# Altium schematic sheet DRIVER_A.SchDoc
size 420 x 297 mm; SheetNumber: 2; PageSetup: Record=PageOptions|CenterHorizontal=False|CenterVertical=False|PrintScale=0.95|XCorrection=0.00|YCorrection=0.00|PrintKind=1|BorderSize=5000000|LeftOffset=0|BottomOffset=0|Orientation=1|PaperLength=1000|PaperWidth=1000|Scale=100|PaperSource=15|PrintQuality=600|MediaType=1|DitherType=10|PaperKind=A4|PrintScaleMode=1
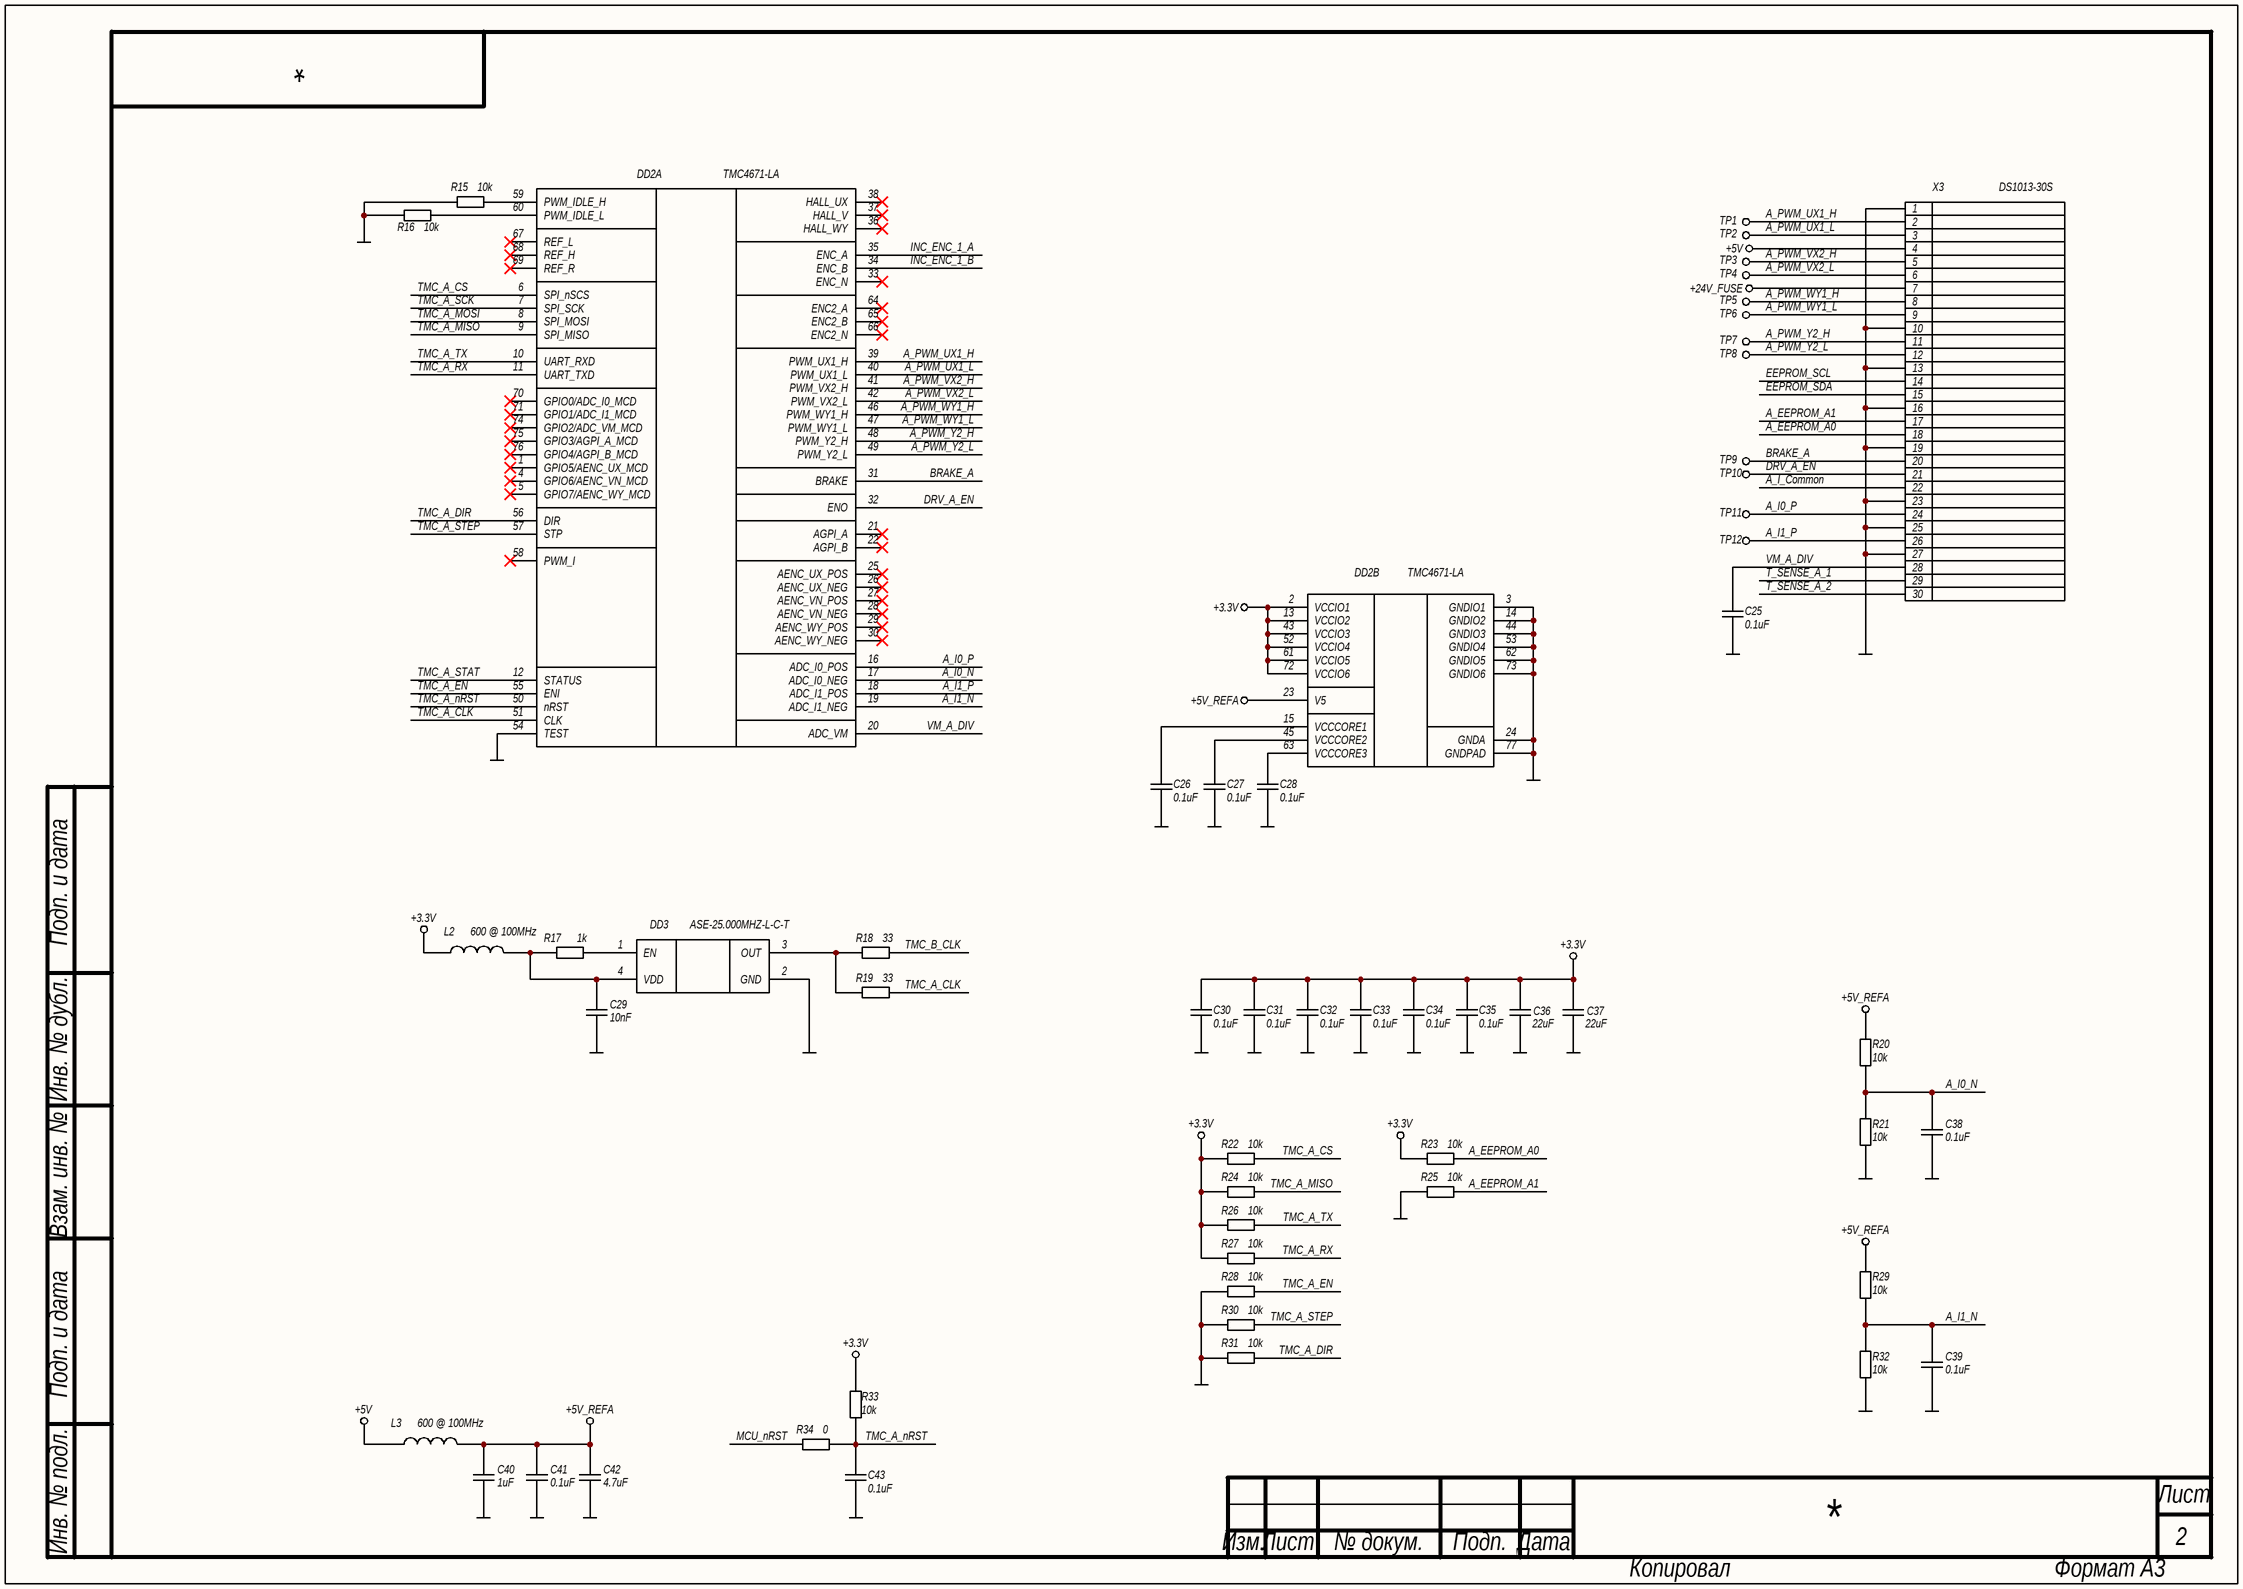
[diagram p0: DRIVER_A.SchDoc]

## Parts
C25  0.1uF  [C0603N]
C26  0.1uF  [C0603N]
C27  0.1uF  [C0603N]
C28  0.1uF  [C0603N]
C29  10nF  [C0603N]
C30  0.1uF  [C0603N]
C31  0.1uF  [C0603N]
C32  0.1uF  [C0603N]
C33  0.1uF  [C0603N]
C34  0.1uF  [C0603N]
C35  0.1uF  [C0603N]
C36  22uF  [C0805N]
C37  22uF  [C0805N]
C38  0.1uF  [C0603N]
C39  0.1uF  [C0603N]
C40  1uF  [C0603N]
C41  0.1uF  [C0603N]
C42  4.7uF  [C0603N]
C43  0.1uF  [C0603N]
DD2  TMC4671-LA  [QFN76-EP]  (parts A,B of 2)
DD3  ASE-25.000MHZ-L-C-T  [ASE]
L2  600 @ 100MHz  [FB0603N]
L3  600 @ 100MHz  [FB0603N]
R15  10k  [R0603N]
R16  10k  [R0603N]
R17  1k  [R0603N]
R18  33  [R0603N]
R19  33  [R0603N]
R20  10k  [R0603N]
R21  10k  [R0603N]
R22  10k  [R0603N]
R23  10k  [R0603N]
R24  10k  [R0603N]
R25  10k  [R0603N]
R26  10k  [R0603N]
R27  10k  [R0603N]
R28  10k  [R0603N]
R29  10k  [R0603N]
R30  10k  [R0603N]
R31  10k  [R0603N]
R32  10k  [R0603N]
R33  10k  [R0603N]
R34  0  [R0603N]
TP1  TEST_POINT  [TP_RPAD_0.8MM]  (value not drawn)  (no BOM)
TP2  TEST_POINT  [TP_RPAD_0.8MM]  (value not drawn)  (no BOM)
TP3  TEST_POINT  [TP_RPAD_0.8MM]  (value not drawn)  (no BOM)
TP4  TEST_POINT  [TP_RPAD_0.8MM]  (value not drawn)  (no BOM)
TP5  TEST_POINT  [TP_RPAD_0.8MM]  (value not drawn)  (no BOM)
TP6  TEST_POINT  [TP_RPAD_0.8MM]  (value not drawn)  (no BOM)
TP7  TEST_POINT  [TP_RPAD_0.8MM]  (value not drawn)  (no BOM)
TP8  TEST_POINT  [TP_RPAD_0.8MM]  (value not drawn)  (no BOM)
TP9  TEST_POINT  [TP_RPAD_0.8MM]  (value not drawn)  (no BOM)
TP10  TEST_POINT  [TP_RPAD_0.8MM]  (value not drawn)  (no BOM)
TP11  TEST_POINT  [TP_RPAD_0.8MM]  (value not drawn)  (no BOM)
TP12  TEST_POINT  [TP_RPAD_0.8MM]  (value not drawn)  (no BOM)
X3  DS1013-30S  [2.54_2X15_HEADER_BOX]

## Nets
+3.3V: C30.2 C31.2 C32.2 C33.2 C34.2 C35.2 C36.2 C37.2 DD2.2(VCCIO1) DD2.13(VCCIO2) DD2.43(VCCIO3) DD2.52(VCCIO4) DD2.61(VCCIO5) DD2.72(VCCIO6) L2.2 R22.2 R23.2 R24.2 R26.2 R27.2 R33.2
+5V: L3.1 X3.4
+5V_REFA: C40.2 C41.2 C42.2 DD2.23(V5) L3.2 R20.2 R29.2
+24V_FUSE: X3.7
GND: C25.1 C26.1 C27.1 C28.1 C29.2 C30.1 C31.1 C32.1 C33.1 C34.1 C35.1 C36.1 C37.1 C38.1 C39.1 C40.1 C41.1 C42.1 C43.1 DD2.3(GNDIO1) DD2.14(GNDIO2) DD2.24(GNDA) DD2.44(GNDIO3) DD2.53(GNDIO4) DD2.54(TEST) DD2.62(GNDIO5) DD2.73(GNDIO6) DD2.77(GNDPAD) DD3.2(GND) R15.2 R16.2 R21.1 R25.2 R28.2 R30.2 R31.2 R32.1 X3.1 X3.10 X3.13 X3.16 X3.19 X3.23 X3.25 X3.27
A_EEPROM_A0: R23.1 X3.18
A_EEPROM_A1: R25.1 X3.17
A_I0_N: C38.2 DD2.17(ADC_I0_NEG) R20.1 R21.2
A_I0_P: DD2.16(ADC_I0_POS) TP11.1 X3.24
A_I1_N: C39.2 DD2.19(ADC_I1_NEG) R29.1 R32.2
A_I1_P: DD2.18(ADC_I1_POS) TP12.1 X3.26
A_I_Common: X3.22
A_PWM_UX1_H: DD2.39(PWM_UX1_H) TP1.1 X3.2
A_PWM_UX1_L: DD2.40(PWM_UX1_L) TP2.1 X3.3
A_PWM_VX2_H: DD2.41(PWM_VX2_H) TP3.1 X3.5
A_PWM_VX2_L: DD2.42(PWM_VX2_L) TP4.1 X3.6
A_PWM_WY1_H: DD2.46(PWM_WY1_H) TP5.1 X3.8
A_PWM_WY1_L: DD2.47(PWM_WY1_L) TP6.1 X3.9
A_PWM_Y2_H: DD2.48(PWM_Y2_H) TP7.1 X3.11
A_PWM_Y2_L: DD2.49(PWM_Y2_L) TP8.1 X3.12
BRAKE_A: DD2.31(BRAKE) TP9.1 X3.20
DRV_A_EN: DD2.32(ENO) TP10.1 X3.21
EEPROM_SCL: X3.14
EEPROM_SDA: X3.15
INC_ENC_1_A: DD2.35(ENC_A)
INC_ENC_1_B: DD2.34(ENC_B)
MCU_nRST: R34.2
T_SENSE_A_1: X3.29
T_SENSE_A_2: X3.30
TMC_A_CLK: DD2.51(CLK) R19.1
TMC_A_CS: DD2.6(SPI_nSCS) R22.1
TMC_A_DIR: DD2.56(DIR) R31.1
TMC_A_EN: DD2.55(ENI) R28.1
TMC_A_MISO: DD2.9(SPI_MISO) R24.1
TMC_A_MOSI: DD2.8(SPI_MOSI)
TMC_A_nRST: C43.2 DD2.50(nRST) R33.1 R34.1
TMC_A_RX: DD2.11(UART_TXD) R27.1
TMC_A_SCK: DD2.7(SPI_SCK)
TMC_A_STAT: DD2.12(STATUS)
TMC_A_STEP: DD2.57(STP) R30.1
TMC_A_TX: DD2.10(UART_RXD) R26.1
TMC_B_CLK: R18.1
VM_A_DIV: C25.2 DD2.20(ADC_VM) X3.28
NetC26_2: C26.2 DD2.15(VCCCORE1)
NetC27_2: C27.2 DD2.45(VCCCORE2)
NetC28_2: C28.2 DD2.63(VCCCORE3)
NetC29_1: C29.1 DD3.4(VDD) L2.1 R17.1
NetDD2_59: DD2.59(PWM_IDLE_H) R15.1
NetDD2_60: DD2.60(PWM_IDLE_L) R16.1
NetDD3_1: DD3.1(EN) R17.2
NetDD3_3: DD3.3(OUT) R18.2 R19.2

Not connected (* = marked no-connect by the designer): DD2 1(GPIO5/AENC_UX_MCD)* 4(GPIO6/AENC_VN_MCD)* 5(GPIO7/AENC_WY_MCD)* 21(AGPI_A)* 22(AGPI_B)* 25(AENC_UX_POS)* 26(AENC_UX_NEG)* 27(AENC_VN_POS)* 28(AENC_VN_NEG)* 29(AENC_WY_POS)* 30(AENC_WY_NEG)* 33(ENC_N)* 36(HALL_WY)* 37(HALL_V)* 38(HALL_UX)* 58(PWM_I)* 64(ENC2_A)* 65(ENC2_B)* 66(ENC2_N)* 67(REF_L)* 68(REF_H)* 69(REF_R)* 70(GPIO0/ADC_I0_MCD)* 71(GPIO1/ADC_I1_MCD)* 74(GPIO2/ADC_VM_MCD)* 75(GPIO3/AGPI_A_MCD)* 76(GPIO4/AGPI_B_MCD)*

## Notes on the sheet
- Подп. и дата
- Инв. № дубл.
- Взам. инв. №
- Инв. № подл.
- Лист
- Изм.
- № докум.
- Подп.
- Дата
- Копировал
- Формат А3

## Library data of the parts
C25-C28 C30-C35 C38 C39 C41 C43 = CL10B104KB8NNNC: Конденсатор; Точность: 10%; Напряжение: 50V; Диэлектрик: X7R; Производитель: Samsung Electro-Mechanics; Описание: 0.1 µF ±10% 50V Ceramic Capacitor X7R 0603 (1608 Metric); Корпус: 0603 (1608 Metric); Температурный диапазон: -55°C ~ 125°C; Вид монтажа: SMD; Артикул: CL10B104KB8NNNC; Номинал: 0.1uF; Строка для документации: https://mm.digikey.com/Volume0/opasdata/d220001/medias/docus/609/CL10B104KB8NNNC_Spec.pdf; Тип элемента: Конденсатор
C29 = CL10B103KB8NNNC: Конденсатор; Точность: 10%; Напряжение: 16V; Диэлектрик: X7R; Производитель: Samsung Electro-Mechanics; Описание: 10000 pF ±10% 50V Ceramic Capacitor X7R 0603 (1608 Metric); Корпус: 0603 (1608 Metric); Температурный диапазон: -55°C ~ 125°C; Вид монтажа: SMD; Артикул: CL10B103KB8NNNC; Номинал: 10nF; Строка для документации: https://mm.digikey.com/Volume0/opasdata/d220001/medias/docus/609/CL10B103KB8NNNC_Spec.pdf; Тип элемента: Конденсатор
C36 C37 = CL21A226MOCLRNC: Конденсатор; Точность: 20%; Напряжение: 16V; Диэлектрик: X5R; Производитель: Samsung Electro-Mechanics; Описание: 22 µF ±20% 16V Ceramic Capacitor X5R 0805 (2012 Metric); Корпус: 0805 (2012 Metric); Температурный диапазон: -55°C ~ 85°C; Вид монтажа: SMD; Артикул: CL21A226MOCLRNC; Номинал: 22uF; Строка для документации: https://mm.digikey.com/Volume0/opasdata/d220001/medias/docus/43/CL21A226MOCLRNC_Spec.pdf; Тип элемента: Конденсатор
C40 = CL10B105KO8NNNC: Конденсатор; Точность: 10%; Напряжение: 16V; Диэлектрик: X7R; Производитель: YAGEO; Описание: 1 µF ±10% 16V Ceramic Capacitor X7R 0603 (1608 Metric); Корпус: 0603 (1608 Metric); Температурный диапазон: -55°C ~ 125°C; Вид монтажа: SMD; Артикул: CL10B105KO8NNNC; Номинал: 1uF; Строка для документации: https://weblib.samsungsem.com/mlcc/mlcc-ec-data-sheet.do?partNumber=CL10B105KO8NNN; Тип элемента: Конденсатор
C42 = CL10A475KO8NNNC: Конденсатор; Точность: 10%; Напряжение: 16V; Диэлектрик: X5R; Производитель: Samsung Electro-Mechanics; Описание: 4.7 µF ±10% 16V Ceramic Capacitor X5R 0603 (1608 Metric); Корпус: 0603 (1608 Metric); Температурный диапазон: -55°C ~ 85°C; Вид монтажа: SMD; Артикул: CL10A475KO8NNNC; Номинал: 4.7uF; Строка для документации: https://mm.digikey.com/Volume0/opasdata/d220001/medias/docus/2328/CL10A475KO8NNNC_Spec.pdf; Тип элемента: Конденсатор
DD2 = TMC4671-LA: Микросхема драйвер двигателя; Производитель: Analog Devices Inc.; Описание: Multiphase Motor Driver Power MOSFET SPI, Step/Direction 76-QFN (10.5x6.5); Корпус: 76-VFQFN Exposed Pad; Температурный диапазон: -40°C ~ 125°C (TJ); Вид монтажа: SMD; Артикул: TMC4671-LA; Строка для документации: https://www.analog.com/media/en/technical-documentation/data-sheets/TMC4671-LA_datasheet_Rev2.07.pdf; Тип элемента: Микросхема
DD3 = ASE-25.000MHZ-L-C-T: Кварцевый генератор; Частота: 25MHz; Точность: ±50ppm; Описание: 25 MHz XO (Standard) CMOS Oscillator 3.3V Enable/Disable 4-SMD, No Lead; Тип: XO (Standard); Производитель: Abracon LLC; Температурный диапазон: -40°C ~ 85°C; Корпус: 3.20mm x 2.50mm; Вид монтажа: SMD; Артикул: ASE-25.000MHZ-L-C-T; Строка для документации: https://abracon.com/Oscillators/ASEseries.pdf; Тип элемента: Кварцевый генератор
L2 L3 = BLM18AG601SN1D: Фильтр ЭМП индуктивный; Ток: 500mA; Сопротивление: 380m; Тип: Ferrite Bead; Производитель: Murata Electronics; Описание: 600 Ohms @ 100 MHz 1 Ferrite Bead 0603 (1608 Metric) 500mA 380mOhm; Корпус: 0603 (1608 Metric); Температурный диапазон: -55°C ~ 125°C; Вид монтажа: SMD; Артикул: BLM18AG601SN1D; Номинал: 600 @ 100MHz; Строка для документации: https://www.murata.com/en-us/products/productdata/8796738650142/ENFA0003.pdf; Тип элемента: Фильтр ЭМП
R15 R16 R20-R33 = RC0603FR-0710KL: Резистор; Точность: 1%; ТКС: ±100ppm/°C; Напряжение: 75V; Производитель: YAGEO; Описание: 10 kOhms ±1% 0.1W, 1/10W Chip Resistor 0603 (1608 Metric) Moisture Resistant Thick Film; Корпус: 0603 (1608 Metric); Температурный диапазон: -55°C ~ 155°C; Вид монтажа: SMD; Артикул: RC0603FR-0710KL; Номинал: 10k; Строка для документации: https://www.yageo.com/upload/media/product/app/datasheet/rchip/pyu-rc_group_51_rohs_l.pdf; Тип элемента: Резистор
R17 = RC0603FR-071KL: Резистор; Точность: 1%; ТКС: ±100ppm/°C; Напряжение: 75V; Производитель: YAGEO; Описание: 1 kOhms ±1% 0.1W, 1/10W Chip Resistor 0603 (1608 Metric) Moisture Resistant Thick Film; Корпус: 0603 (1608 Metric); Температурный диапазон: -55°C ~ 155°C; Вид монтажа: SMD; Артикул: RC0603FR-071KL; Номинал: 1k; Строка для документации: https://www.yageo.com/upload/media/product/app/datasheet/rchip/pyu-rc_group_51_rohs_l.pdf; Тип элемента: Резистор
R18 R19 = RC0603FR-0733RL: Резистор; Точность: 1%; ТКС: ±100ppm/°C; Напряжение: 75V; Производитель: YAGEO; Описание: 33 Ohms ±1% 0.1W, 1/10W Chip Resistor 0603 (1608 Metric) Moisture Resistant Thick Film; Корпус: 0603 (1608 Metric); Температурный диапазон: -55°C ~ 155°C; Вид монтажа: SMD; Артикул: RC0603FR-0733RL; Номинал: 33; Строка для документации: https://www.yageo.com/upload/media/product/app/datasheet/rchip/pyu-rc_group_51_rohs_l.pdf; Тип элемента: Резистор
R34 = RC0603FR-070RL: Резистор; Точность: 1%; Напряжение: 75V; Производитель: YAGEO; Описание: 0 Ohms Jumper Chip Resistor 0603 (1608 Metric) Moisture Resistant Thick Film; Корпус: 0603 (1608 Metric); Температурный диапазон: -55°C ~ 155°C; Вид монтажа: SMD; Артикул: RC0603FR-070RL; Номинал: 0; Строка для документации: https://www.yageo.com/upload/media/product/app/datasheet/rchip/pyu-rc_group_51_rohs_l.pdf; Тип элемента: Резистор
TP1-TP12 = Test Point, Round Pad, 0.8mm diameter: Контрольная точка; Количество контактов: 1; Тип элемента: Разъем; Артикул: Test Point, Round Pad, 0.8mm diameter; Тип разъема: Test Point; Описание: Test Point, Round Pad, 0.8mm diameter
X3 = DS1013-30S: Разъем, 30 контактов; Тип разъема: Header, Male Pin; Количество контактов: 30; Шаг контактов: 2.54mm; Ток: 3A; Напряжение: 250V; Производитель: Connfly electronic (Zhenqin); Описание: Connector Header Through Hole 30 position 0.100" (2.54mm); Температурный диапазон: -40°C ~ 105°C; Вид монтажа: Through Hole; Артикул: DS1013-30S; Строка для документации: http://cn.connfly.group/static/upload/file/pdf/DS1013.pdf; Тип элемента: Разъем